# Altium schematic sheet WM-G-MR-08硬件连接.SchDoc
size A4
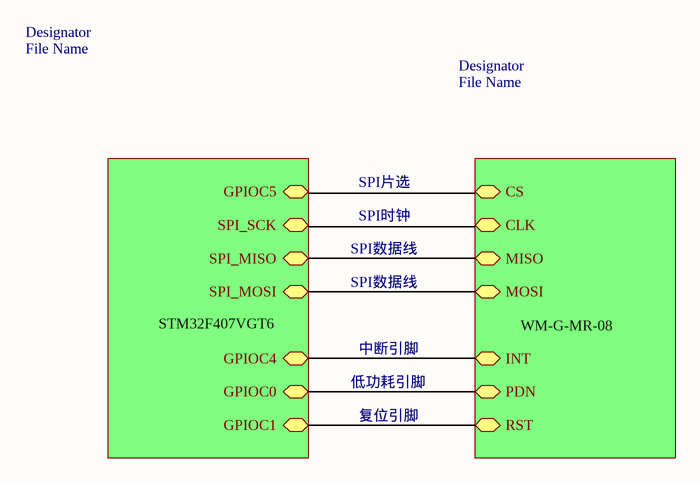
[diagram p0: WM-G-MR-08硬件连接.SchDoc]

## Sub-sheets
Designator = File Name: GPIOC5, SPI_SCK, SPI_MISO, SPI_MOSI, GPIOC0, GPIOC1, GPIOC4
Designator = File Name: CS, CLK, MISO, MOSI, INT, PDN, RST

## Notes on the sheet
- SPI片选
- SPI时钟
- STM32F407VGT6
- SPI数据线
- 低功耗引脚
- 中断引脚
- WM-G-MR-08
- 复位引脚